# EAGLE design SkiMeter (EAGLE 6.6.0)
VERSION: 1.0
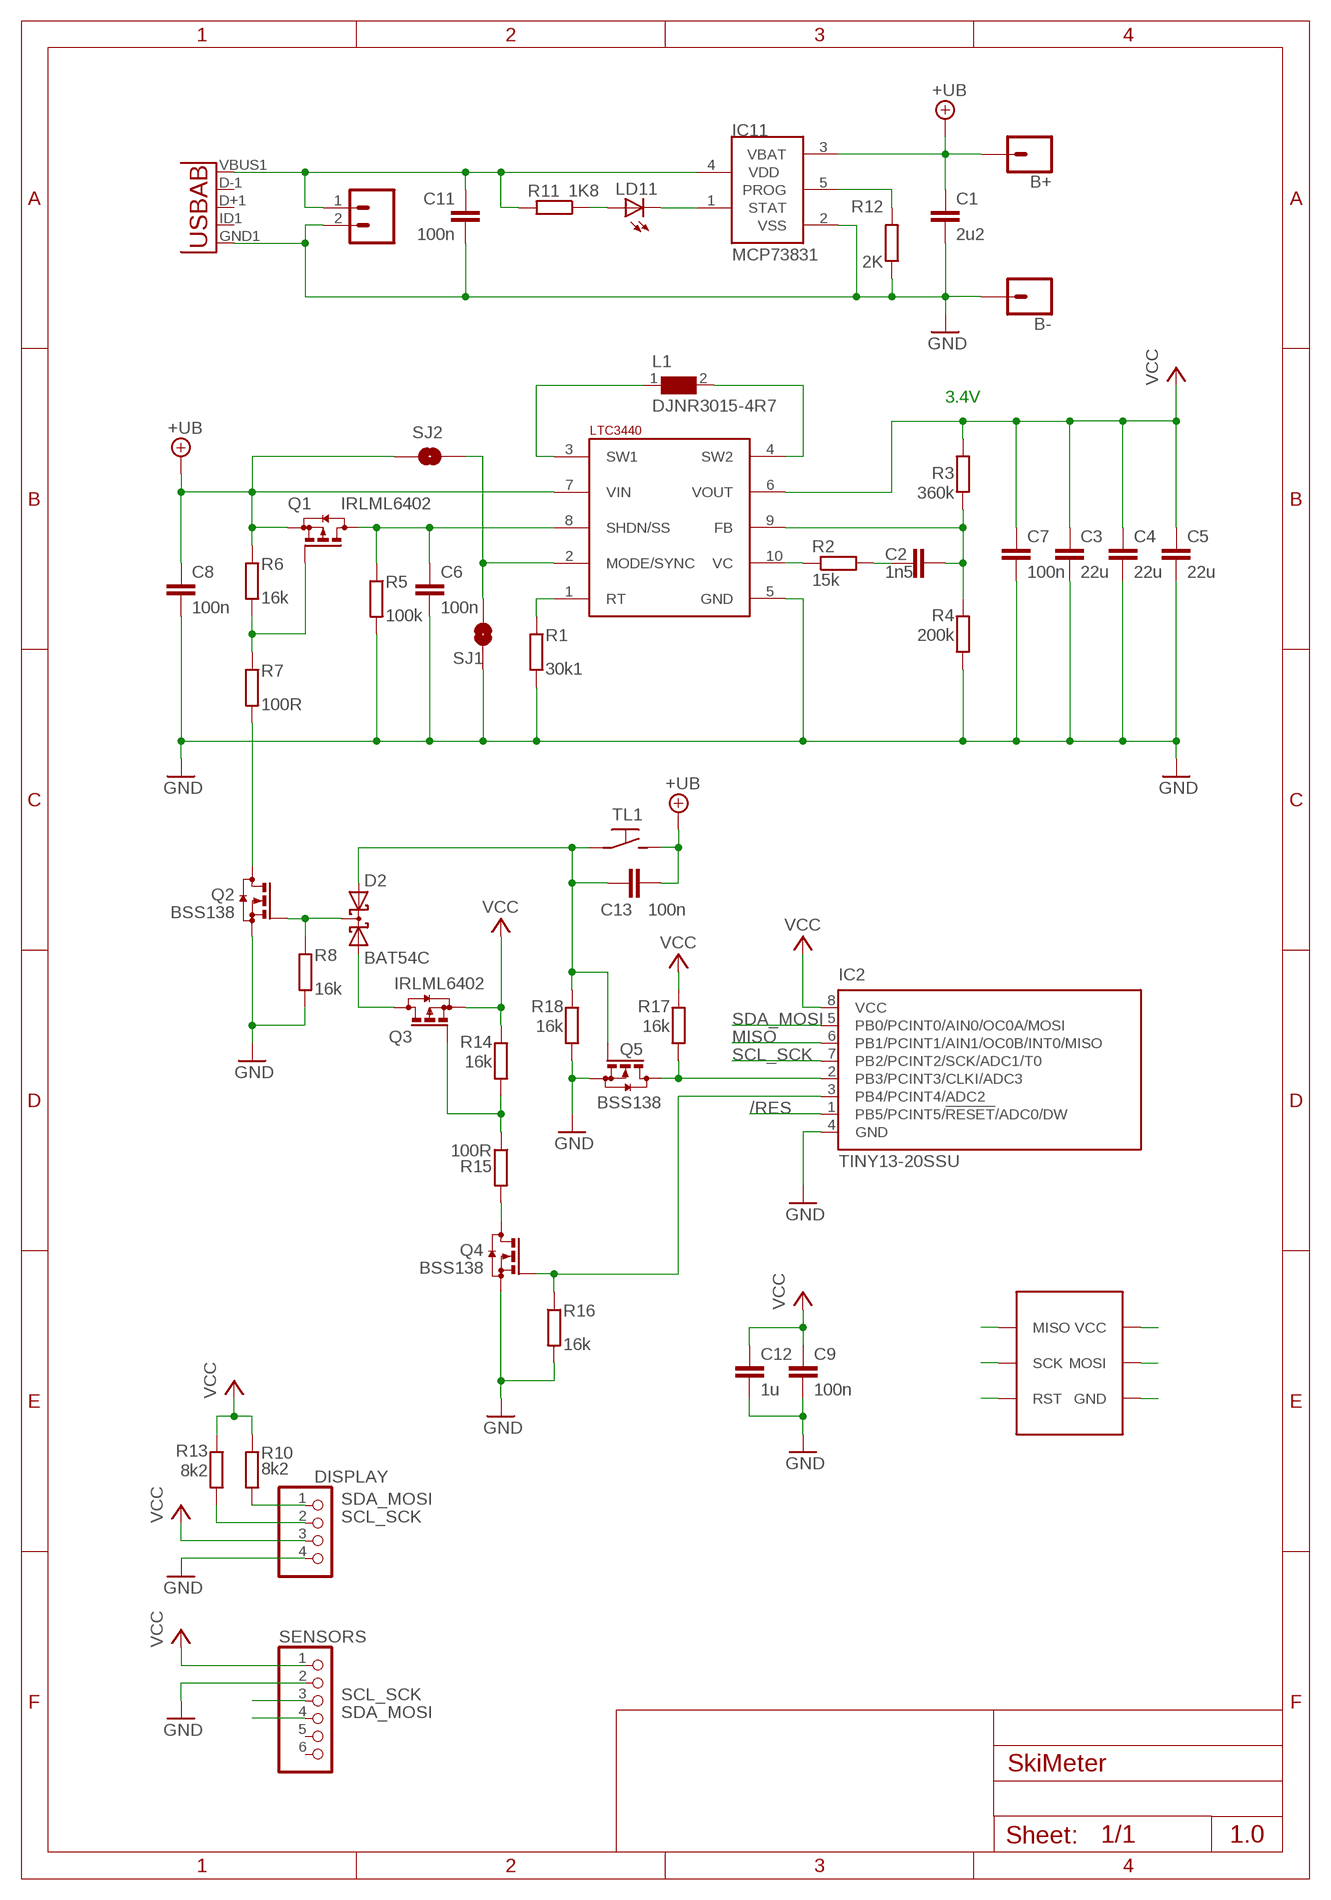
[diagram p0: schematic, sheet 1]

## Parts
+  CONN_02  [1X02]
B+  CONN_01  [1X01]
B-  CONN_01  [1X01]
C1  2u2  C-EUC0805  [C0805]
C2  1n5  C-EUC0805  [C0805]
C3  22u  C-EUC0805  [C0805]
C4  22u  C-EUC0805  [C0805]
C5  22u  C-EUC0805  [C0805]
C6  100n  C-EUC0805  [C0805]
C7  100n  C-EUC0805  [C0805]
C8  100n  C-EUC0805  [C0805]
C9  100n  C-EUC0805  [C0805]
C11  100n  C-EUC0805  [C0805]
C12  1u  C-EUC0805  [C0805]
C13  100n  C-EUC0805  [C0805]
D2  BAT54C  [SOT23]
DISPLAY  PINHD-1X4  [1X04]
IC1  LTC3440  [MSOP10]
IC2  TINY13-20SSU  [8S1]
IC11  MCP73831  [SOT23-5L]
L1  DJNR3015-4R7  WE-LQS_3015  [WE-LQS_3015]
LD11  LEDCHIPLED_0805  [CHIPLED_0805]
Q1  IRLML6402  BSS84  [SOT23]
Q2  BSS138  BSS123  [SOT23]
Q3  IRLML6402  BSS84  [SOT23]
Q4  BSS138  BSS123  [SOT23]
Q5  BSS138  BSS123  [SOT23]
R1  30k1  R-EU_M0805  [M0805]
R2  15k  R-EU_M0805  [M0805]
R3  360k  R-EU_M0805  [M0805]
R4  200k  R-EU_M0805  [M0805]
R5  100k  R-EU_M0805  [M0805]
R6  16k  R-EU_M0805  [M0805]
R7  100R  R-EU_M0805  [M0805]
R8  16k  R-EU_M0805  [M0805]
R10  8k2  R-EU_M0805  [M0805]
R11  1K8  R-EU_M0805  [M0805]
R12  2K  R-EU_M0805  [M0805]
R13  8k2  R-EU_M0805  [M0805]
R14  16k  R-EU_M0805  [M0805]
R15  100R  R-EU_M0805  [M0805]
R16  16k  R-EU_M0805  [M0805]
R17  16k  R-EU_M0805  [M0805]
R18  16k  R-EU_M0805  [M0805]
SENSORS  PINHD-1X6  [1X06]
SJ1  SOLDERJUMPERNO  [SJ_2S-NO]
SJ2  SOLDERJUMPERTRACE  [SJ_2S-TRACE]
TL1  TS1107GS  [TS1107GS]
U1  USB""  [USB-MICRO-SMD]
U$1  ISP  [ISP_PCB]

## Nets
+UB: B+.1 C1.1 C8.1 C13.1 IC1.7(VIN) IC11.3(VBAT) Q1.2(S) R6.1 SJ2.2 TL1.P$2(S)
/RES: IC2.1(PB5/PCINT5/!RESET!/ADC0/DW) U$1.P$5(RST)
FB: C2.2 IC1.9(FB) R3.1 R4.2
GND: +.2 B-.1 C1.2 C3.2 C4.2 C5.2 C6.2 C7.2 C8.2 C9.2 C11.1 C12.2 DISPLAY.4 IC1.5(GND) IC2.4(GND) IC11.2(VSS) Q2.2(S) Q4.2(S) Q5.2(S) R1.2 R4.1 R5.2 R8.2 R12.1 R16.2 R18.2 SENSORS.2 SJ1.1 U1.GND1(GND) U$1.P$6(GND)
MISO: IC2.6(PB1/PCINT1/AIN1/OC0B/INT0/MISO) U$1.P$1(MISO)
N$1: IC1.1(RT) R1.1
N$2: C6.1 IC1.8(SHDN/SS) Q1.3(D) R5.1
N$3: C2.1 R2.2
N$4: Q1.1(G) R6.2 R7.1
N$5: Q2.3(D) R7.2
N$6: IC1.10(VC) R2.1
N$7: D2.3(CC) Q2.1(G) R8.1
N$8: D2.1(A1) Q3.3(D)
N$9: IC11.5(PROG) R12.2
N$10: IC11.1(STAT) LD11.C
N$11: LD11.A R11.1
N$12: C13.2 D2.2(A2) Q5.1(G) R18.1 TL1.P$1(P)
N$13: Q3.1(G) R14.2 R15.1
N$14: Q4.3(D) R15.2
N$15: IC2.3(PB4/PCINT4/ADC2) Q4.1(G) R16.1
N$16: IC2.2(PB3/PCINT3/CLKI/ADC3) Q5.3(D) R17.2
N$17: IC1.2(MODE/SYNC) SJ1.2 SJ2.1
SCL_SCK: DISPLAY.2 IC2.7(PB2/PCINT2/SCK/ADC1/T0) R13.2 SENSORS.3 U$1.P$3(SCK)
SDA_MOSI: DISPLAY.1 IC2.5(PB0/PCINT0/AIN0/OC0A/MOSI) R10.2 SENSORS.4 U$1.P$4(MOSI)
SW1: IC1.3(SW1) L1.1
SW2: IC1.4(SW2) L1.2
U_CHARG: +.1 C11.2 IC11.4(VDD) R11.2 U1.VBUS1(VBUS)
VCC: C3.1 C4.1 C5.1 C7.1 C9.1 C12.1 DISPLAY.3 IC1.6(VOUT) IC2.8(VCC) Q3.2(S) R3.2 R10.1 R13.1 R14.1 R17.1 SENSORS.1 U$1.P$2(VCC)
Unconnected: SENSORS.5 SENSORS.6 U1.D+1(D+) U1.D-1(D-) U1.ID1(USBID)

## Notes on the sheet
- 3.4V

## Library data of the parts
+ = SparkFun-Connectors:CONN_02: Multi connection point. Often used as Generic Header-pin footprint for 0.1 inch spaced/style header connections On any of the 0.1 inch spaced packages, you can populate with these: Break Away Headers - Straight <https://www.sparkfun.com/products/116> (PRT-00116) Break Away Male Headers - Right Angle <https://www.sparkfun.com/products/553> (PRT-00553) Female Headers <https://www.sparkfun.com/products/115> (PRT-00115) Break Away Headers - Machine Pin <https://www.sparkfun.com/products/117> (PRT-00117) Break Away Female Headers - Swiss Machine Pin <https://www.sparkfun.com/products/743> (PRT-00743) For SCREWTERMINALS and SPRING TERMINALS visit here: Screw Terimnals on SparkFun.com <https://www.sparkfun.com/search/results?term=Screw+Terminals> (5mm/3.5mm/2.54mm spacing) This device is also useful as a general connection point to wire up your design to another part of your project. Our various solder wires solder well into these plated through hole pads. Hook-Up Wire - Assortment (Stranded, 22 AWG) <https://www.sparkfun.com/products/11375> (PRT-11375) Hook-Up Wire - Assortment (Solid Core, 22 AWG) <https://www.sparkfun.com/products/11367> (PRT-11367) View the entire wire category on our website here <https://www.sparkfun.com/categories/141> Special notes: Molex polarized connector foot print use with: PRT-08233 with associated crimp pins and housings. 2.54_SCREWTERM for use with PRT-10571. 3.5mm Screw Terminal footprints for PRT-08084 5mm Screw Terminal footprints for use with PRT-08432
B+ B- = SparkFun-Connectors:CONN_01: Single connection point. Often used as Generic Header-pin footprint for 0.1 inch spaced/style header connections On any of the 0.1 inch spaced packages, you can populate with these: Break Away Headers - Straight <https://www.sparkfun.com/products/116> (PRT-00116) Break Away Male Headers - Right Angle <https://www.sparkfun.com/products/553> (PRT-00553) Female Headers <https://www.sparkfun.com/products/115> (PRT-00115) Break Away Headers - Machine Pin <https://www.sparkfun.com/products/117> (PRT-00117) Break Away Female Headers - Swiss Machine Pin <https://www.sparkfun.com/products/743> (PRT-00743) This device is also useful as a general connection point to wire up your design to another part of your project. Our various solder wires solder well into these plated through hole pads. Hook-Up Wire - Assortment (Stranded, 22 AWG) <https://www.sparkfun.com/products/11375> (PRT-11375) Hook-Up Wire - Assortment (Solid Core, 22 AWG) <https://www.sparkfun.com/products/11367> (PRT-11367) View the entire wire category on our website here <https://www.sparkfun.com/categories/141> Special notes: SMTSO-256-ET is a "flush mount" nut for a 4-40 screw. We mostly use this on specialty testbeds; it is a nice way to connect hardware to your PCB at an adjustable hieght. Also note, the SNAP packages are for using a snappable style connector. We sell a baggie of snaps and they are also used on two LilyPad designs: Snap Assortment - 30 pack (male and female) <https://www.sparkfun.com/products/11347> (DEV-11347) LilyPad Arduino SimpleSnap <https://www.sparkfun.com/products/10941> (DEV-10941) LilyPad SimpleSnap Protoboard <https://www.sparkfun.com/products/10940> (DEV-10940)
C1-C9 C11-C13 = rcl:C-EU: CAPACITOR, European symbol
D2 = diode:BAT54C: Schottky Diodes Source: Fairchild .. BAT54.pdf
DISPLAY = pinhead:PINHD-1X4: PIN HEADER
IC1 = seb:LTC3440
IC2 = atmel:TINY13: 8-bit AVR Microcontroller with 1K Bytes In-System Programmable Flash Source: http://www.atmel.com/dyn/resources/prod_documents/2535S.pdf; MPN: ATTINY13-20SSU; OC_FARNELL: 1455133; OC_NEWARK: 58M3771
IC11 = microchip-update-2:MCP73831: Miniature Single-Cell, Fully Integrated Li-Ion, Li-Polymer Charge Management Controllers
L1 = Wurth_Elektronik_Passive_rev15b:WE-LQS_3015: SMD Shielded Tiny Power Inductor -Tiny Power Inductor design -1.7 times more current in comparison with unshielded versions - Robust design& high durability -Low RDC -Magnetically shielded wth magneticc glue reducing buzz noise in ultra-low levels -Operating Temperature:-40°C to +125°C -- Intergrated DC/DC Converters --Switching controllers which required high effiiciency --Portable power(Smartphones,digital cameras,Tablets,etc) --Embedded laptops and PCs --Big sizes(5040,60xx,8040) used for shock-proof circiuts <http://katalog.we-online.de/media/images/eisos/IndLQS_pf2.jpg> Details see: http://katalog.we-online.de/en/pbs/WE-LQS Created by Dan Xu 2014-05-21 2014 (C) Würth Elektronik
LD11 = led:LED: LED OSRAM: - CHIPLED LG R971, LG N971, LY N971, LG Q971, LY Q971, LO R971, LY R971 LH N974, LH R974 LS Q976, LO Q976, LY Q976 LO Q996 - Hyper CHIPLED LW Q18S LB Q993, LB Q99A, LB R99A - SideLED LS A670, LO A670, LY A670, LG A670, LP A670 LB A673, LV A673, LT A673, LW A673 LH A674 LY A675 LS A676, LA A676, LO A676, LY A676, LW A676 LS A679, LY A679, LG A679 - Hyper Micro SIDELED® LS Y876, LA Y876, LO Y876, LY Y876 LT Y87S - SmartLED LW L88C, LW L88S LB L89C, LB L89S, LG L890 LS L89K, LO L89K, LY L89K LS L896, LA L896, LO L896, LY L896 - TOPLED LS T670, LO T670, LY T670, LG T670, LP T670 LSG T670, LSP T670, LSY T670, LOP T670, LYG T670 LG T671, LOG T671, LSG T671 LB T673, LV T673, LT T673, LW T673 LH T674 LS T676, LA T676, LO T676, LY T676, LB T676, LH T676, LSB T676, LW T676 LB T67C, LV T67C, LT T67C, LS T67K, LO T67K, LY T67K, LW E67C LS E67B, LA E67B, LO E67B, LY E67B, LB E67C, LV E67C, LT E67C LW T67C LS T679, LY T679, LG T679 LS T770, LO T770, LY T770, LG T770, LP T770 LB T773, LV T773, LT T773, LW T773 LH T774 LS E675, LA E675, LY E675, LS T675 LS T776, LA T776, LO T776, LY T776, LB T776 LHGB T686 LT T68C, LB T68C - Hyper Mini TOPLED® LB M676 - Mini TOPLED Santana® LG M470 LS M47K, LO M47K, LY M47K Source: http://www.osram.convergy.de LUXEON: - LUMILED® LXK2-PW12-R00, LXK2-PW12-S00, LXK2-PW14-U00, LXK2-PW14-V00 LXK2-PM12-R00, LXK2-PM12-S00, LXK2-PM14-U00 LXK2-PE12-Q00, LXK2-PE12-R00, LXK2-PE12-S00, LXK2-PE14-T00, LXK2-PE14-U00 LXK2-PB12-K00, LXK2-PB12-L00, LXK2-PB12-M00, LXK2-PB14-N00, LXK2-PB14-P00, LXK2-PB14-Q00 LXK2-PR12-L00, LXK2-PR12-M00, LXK2-PR14-Q00, LXK2-PR14-R00 LXK2-PD12-Q00, LXK2-PD12-R00, LXK2-PD12-S00 LXK2-PH12-R00, LXK2-PH12-S00 LXK2-PL12-P00, LXK2-PL12-Q00, LXK2-PL12-R00 Source: www.luxeon.com KINGBRIGHT: KA-3528ASYC Source: www.kingbright.com
Q1 Q3 = transistor-small-signal:BSS84: P-CHANNEL MOS FET
Q2 Q4 Q5 = transistor-small-signal:BSS123: N-CHANNEL MOS FET
R1-R8 R10-R18 = rcl:R-EU_: RESISTOR, European symbol
SENSORS = pinhead:PINHD-1X6: PIN HEADER
SJ1 SJ2 = SteMarie:SOLDERJUMPER: Solder Jumper Standard SMD solder jumper. Used to automate production. Two varients : Normally Open and Normally Closed are the same, but have different paste layers. NC will have a large amount of paste and should jumper during reflow.
TL1 = switchs:TS1107GS
U1 = MicroUSB:USB: This is a USB AB connector that is compatible with USB OTG. i.e. this connector can serve as a host or device
U$1 = isp:ISP

## Board
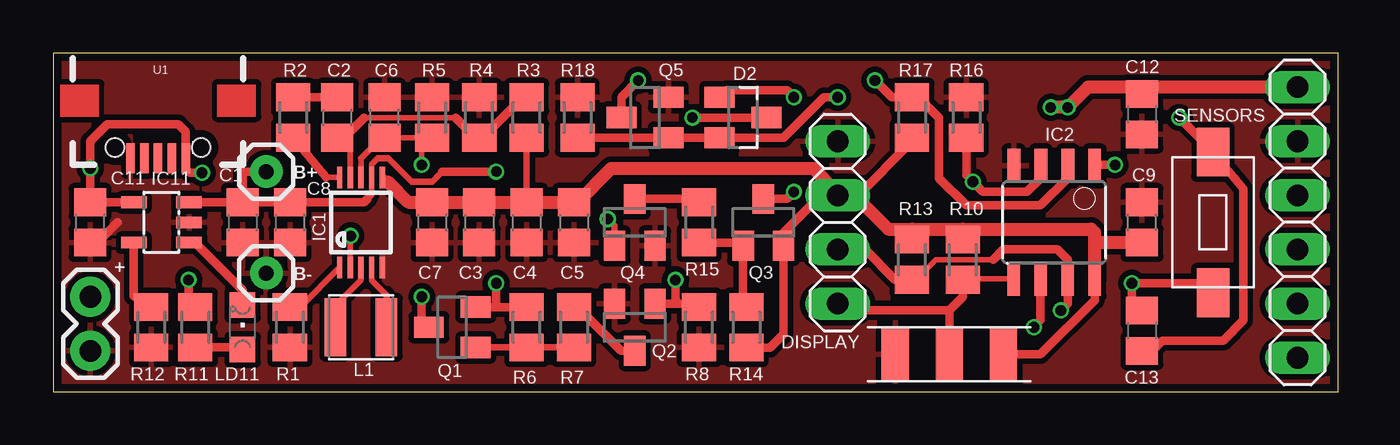
[diagram p1: board, top side]
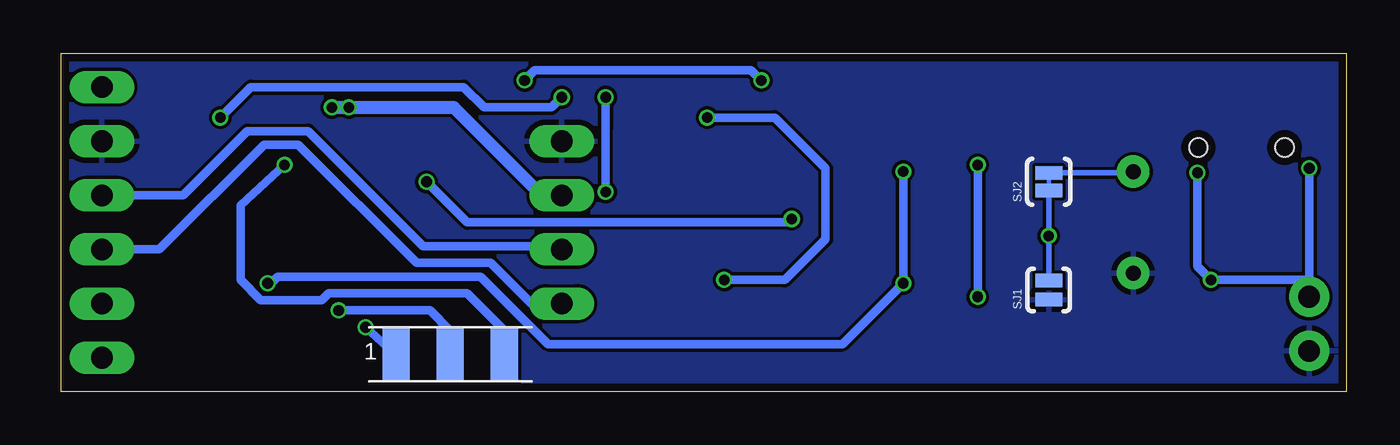
[diagram p2: board, bottom side, seen from below]

Size 60.33 x 15.88 mm. Coordinates in mm from the lower left corner, seen from the top.
Outline: 0,0 60.33,0 60.33,15.88 0,15.88 0,0
Copper layers (1*16): Top 0.035559375mm / dielectric 1.6mm / Bottom 0.035559375mm
Design rules "oshpark-2layer *": minimum track width 6mil, minimum drill 10mil, track to track 6mil, track to pad 6mil, pad to pad 6mil, via to via 6mil, smd to smd 6mil, copper to edge 15mil, drill to drill 6mil, minimum pad ring 5mil, minimum via ring 5mil, stop-mask expansion 0mil, vias tented up to drill 0mil, thermal gap 10mil

### Footprints (pad centres in the part's own frame; a part is rotated, then mirrored left to right if it is on the bottom)
1X02 = drill 1.016 pad 1.88: 1 0,0; 2 2.54,0
1X01 = drill 0.7 pad 1.524: 1 0,0
C0805 = smd 1.3 x 1.5: 1 -0.95,0; 2 0.95,0
SOT23 = smd 1 x 1.4: 1 -0.95,-1.1; 2 0.95,-1.1; 3 0,1.1
1X04 = drill 1.016 long: 1 -3.81,0; 2 -1.27,0; 3 1.27,0; 4 3.81,0
MSOP10 = smd 0.25 x 1: 1 -1,-2.113; 2 -0.5,-2.113; 3 0,-2.113; 4 0.5,-2.113; 5 1,-2.113; 6 1,2.113; 7 0.5,2.113; 8 0,2.113; 9 -0.5,2.113; 10 -1,2.113
8S1 = smd 0.6 x 1.6: 1 -1.905,-2.654; 2 -0.645,-2.654; 3 0.625,-2.654; 4 1.895,-2.654; 5 1.905,2.654; 6 0.635,2.654; 7 -0.635,2.654; 8 -1.905,2.654
SOT23-5L = smd 0.55 x 1.2: 1 -0.95,-1.3; 2 0,-1.3; 3 0.95,-1.3; 4 0.95,1.3; 5 -0.95,1.3
WE-LQS_3015 = smd 1 x 2.7: 1 -1.2,0; 2 1.2,0
CHIPLED_0805 = smd 1.2 x 1.2: A 0,-1.05; C 0,1.05
M0805 = smd 1.3 x 1.6: 1 -0.95,0; 2 0.95,0
1X06 = drill 1.016 long: 1 -6.35,0; 2 -3.81,0; 3 -1.27,0; 4 1.27,0; 5 3.81,0; 6 6.35,0
SJ_2S-NO = smd 0.635 x 1.27: 1 -0.45,0; 2 0.45,0
SJ_2S-TRACE = smd 0.635 x 1.27: 1 -0.419,0; 2 0.419,0
TS1107GS = smd 2.286 x 1.524: P$1 -3.302,0; P$2 3.302,0
USB-MICRO-SMD = smd 1.4 x 0.4: D+1 2.7,0; D-1 2.7,0.65; GND1 2.7,-1.3; ID1 2.7,-0.65; VBUS1 2.7,1.3 | hole 0.85: 2.2,2.027; 2.2,-2.027
ISP_PCB = smd 1.27 x 2.54: P$1 -2.54,0; P$3 0,0; P$5 2.54,0 | smd 1.27 x 2.54 bottom: P$2 -2.54,0; P$4 0,0; P$6 2.54,0

### Placement (x,y rotation side)
+  1.75,4.45 270 top
B+  10,10.32 0 top
B-  10,5.56 0 top
C1  8.89,7.94 270 top
C2  13.34,12.86 270 top
C3  20,7.94 270 top
C4  22.23,7.94 270 top
C5  24.45,7.94 270 top
C6  15.56,12.86 90 top
C7  17.78,7.94 270 top
C8  11.11,7.94 270 top
C9  51.12,7.94 90 top
C11  1.73,7.94 90 top
C12  51.12,13.02 270 top
C13  51.12,2.86 270 top
D2  32.38,12.86 270 top
DISPLAY  36.83,7.94 90 top
IC1  14.45,7.94 0 top
IC2  46.99,7.94 180 top
IC11  5.08,7.94 90 top
L1  14.45,3.02 0 top
LD11  8.89,3.02 0 top
Q1  18.73,3.02 90 top
Q2  27.3,3.02 180 top
Q3  33.34,7.94 0 top
Q4  27.3,7.94 0 top
Q5  27.78,12.86 90 top
R1  11.11,3.02 270 top
R2  11.27,12.86 90 top
R3  22.23,12.86 270 top
R4  20,12.86 270 top
R5  17.78,12.86 90 top
R6  22.23,3.02 270 top
R7  24.45,3.02 90 top
R8  30.32,3.02 270 top
R10  42.7,6.19 270 top
R11  6.67,3.02 90 top
R12  4.6,3.02 90 top
R13  40.32,6.19 270 top
R14  32.54,3.02 90 top
R15  30.32,7.94 90 top
R16  42.86,12.86 90 top
R17  40.32,12.86 90 top
R18  24.61,12.86 90 top
SENSORS  58.42,7.94 270 top
SJ1  13.97,4.76 90 bottom
SJ2  13.97,9.84 90 bottom
TL1  54.45,7.94 270 top
U1  4.92,13.65 270 top
U$1  42.07,1.75 0 bottom

### Tracks (layer width: path | path; a pad name or v marks a point on that pad's centre or on a via)
+UB  (via drill 0.5)
  Top 0.254: 14.76,9.05 14.95,9.23 IC1.7 14.95,10.66 15.24,10.95
  Top 0.305: 15.24,10.95 15.72,10.95 16.83,9.84 17.78,9.84 18.26,10.32
  Top 0.406: 14.76,9.05 14.6,8.89 C8.1 C1.1 | 18.26,10.32 v20.8,10.32 | R6.1 20.8,3.97 | 20.8,3.97 Q1.2 | v20.8,5.08 20.8,3.97 | IC11.3 C1.1 | C1.1 8.89,10.32 B+.1 | TL1.P$2 54.45,5.08 v50.64,5.08 50.64,4.28 C13.1
  Bottom 0.254: SJ2.2 10.06,10.26 B+.1
  Bottom 0.406: v20.8,10.32 v20.8,5.08 23.65,2.22 37.47,2.22 40.64,5.4 50.16,5.4 50.48,5.08 v50.64,5.08
/RES  (via drill 0.5)
  Top 0.406: IC2.1 48.94,10.64 v49.85,10.64
  Bottom 0.406: U$1.P$5 39.21,2.54 41.27,4.6 47.78,4.6 48.1,4.29 50.96,4.29 51.91,5.24 51.91,8.73 v49.85,10.64
FB
  Top 0.254: IC1.9 13.95,11.3 | 13.95,11.3 C2.2 | 13.95,11.3 13.95,12.2 | 14.61,12.86 18.89,12.86 | 19.84,11.91 R4.2 20.16,11.91 | 22.06,13.81 R3.1
  Top 0.406: 13.95,12.2 14.61,12.86 | 18.89,12.86 19.84,11.91 | 20.16,11.91 22.06,13.81
GND
  Top 0.406: 3.02,7.94 2.22,7.14 1.9,7.14 C11.1
  pour Top (isolate 0.254, rank 6): 0,15.88 0,0 60.17,0 60.17,15.88
  pour Top (rank 6, no thermals): 15.56,6.67 15.56,5.08 16.67,5.08 16.67,6.67
  pour Bottom: 0.16,15.72 60.17,15.72 60.17,0.16 0.16,0.16
MISO  (via drill 0.5)
  Top 0.406: IC2.6 46.35,3.33 v46.04,3.02
  Bottom 0.406: v46.04,3.02 44.29,1.43 U$1.P$1
N$1
  Top 0.254: IC1.1 11.59,3.97 R1.1
N$2  (via drill 0.5)
  Top 0.254: IC1.8 14.45,10.96 | C6.1 R5.1 17.31,11.91 v17.3,10.64
  Top 0.305: 17.3,3.35 Q1.3 | 14.45,10.96 15.4,11.91 C6.1
  Top 0.406: v17.3,4.45 17.3,3.35
  Bottom 0.406: v17.3,10.64 v17.3,4.45
N$3
  Top 0.406: C2.1 R2.2
N$4
  Top 0.305: Q1.1 R6.2 R7.1
N$5
  Top 0.406: R7.2 24.61,3.97 26.66,1.92 Q2.3
N$6
  Top 0.254: IC1.10 12.81,10.05
  Top 0.406: 12.81,10.05 R2.1
N$7  (via drill 0.5)
  Top 0.406: Q2.1 29.37,4.12 | 29.37,4.12 30.17,4.12 R8.1 | D2.3 v30,12.86 | v29.21,5.24 29.21,4.28 29.37,4.12
  Bottom 0.406: v30,12.86 26.83,12.86 24.45,10.48 24.45,7.14 26.35,5.24 v29.21,5.24
N$8  (via drill 0.5)
  Top 0.406: D2.1 31.61,14.13 34.45,14.13 v34.77,13.81 | Q3.3 34.44,9.04 v34.77,9.37
  Bottom 0.406: 34.77,12.38 v34.77,13.81 v34.77,9.37
N$9
  Top 0.406: R12.2 3.78,4.47 IC11.5
N$10
  Top 0.406: LD11.C 8.89,4.76 6.67,6.99 IC11.1
N$11
  Top 0.406: LD11.A 8.79,2.07 R11.1
N$12  (via drill 0.5)
  Top 0.406: v36.83,13.81 36.2,13.81 34.29,11.91 D2.2 Q5.1 R18.1 | v52.86,12.86 54.17,11.56 | 54.17,11.56 TL1.P$1 | 54.17,11.56 55.88,9.53 55.88,3.33 54.93,2.38 52.07,2.38 51.75,2.06 51.27,2.06 C13.2
  Bottom 0.406: v52.86,12.86 51.44,14.29 41.43,14.29 40.48,13.34 37.31,13.34 v36.83,13.81
N$13
  Top 0.406: R15.1 32.38,6.99 Q3.1 32.39,4.12 R14.2
N$14
  Top 0.406: Q4.3 30.17,9.04 R15.2
N$15  (via drill 0.5)
  Top 0.305: 46.37,10.01 IC2.3 46.35,10.76 | v43.18,9.84 42.86,10.16 | Q4.1 26.36,7.78 v26.04,8.1
  Top 0.406: 46.37,10.01 45.72,9.37 43.66,9.37 v43.18,9.84 | 42.86,10.16 R16.1
  Bottom 0.406: v26.04,8.1 26.19,7.94 41.27,7.94 v43.18,9.84
N$16  (via drill 0.5)
  Top 0.305: IC2.2 47.63,10.01 | 40.33,13.49 R17.2
  Top 0.406: 47.63,10.01 46.35,8.73 42.86,8.73 41.59,10 41.59,12.86 40.48,13.97 R17.2 39.37,13.81 v38.58,14.61 | v27.46,14.61 26.68,13.82 Q5.3
  Bottom 0.406: v38.58,14.61 38.1,15.08 27.94,15.08 v27.46,14.61
N$17  (via drill 0.5)
  Top 0.254: IC1.2 13.95,7.17 v13.97,7.3
  Bottom 0.254: SJ1.2 v13.97,7.3 SJ2.1
SCL_SCK  (via drill 0.5)
  Top 0.254: R13.2 40.48,5.24 41.43,6.19 44.13,6.19
  Top 0.406: 44.13,6.19 44.61,6.67 47.15,6.67 47.62,6.19 IC2.7 47.62,4.13 v47.31,3.81 | R13.2 39.53,5.24 38.1,6.67 DISPLAY.2
  Bottom 0.406: v47.31,3.81 43.02,3.81 42.07,2.86 U$1.P$3 | SENSORS.3 54.61,9.21 51.59,12.22 48.74,12.22 43.34,6.83 36.83,6.83 DISPLAY.2
SDA_MOSI
  Top 0.254: IC2.5 42.75,5.28 R10.2
  Top 0.406: DISPLAY.1 37.31,3.81 42.07,3.81 | 42.07,3.81 42.7,4.45 R10.2 | 42.07,3.81 U$1.P$4
  Bottom 0.406: SENSORS.4 55.72,6.67 50.8,11.59 49.21,11.59 43.66,6.03 40.16,6.03 38.26,4.13 DISPLAY.1
SW1
  Top 0.254: IC1.3 14.45,5.24 14.29,5.08
  Top 0.305: 14.29,5.08 13.34,4.13 13.34,3.1 L1.1
SW2
  Top 0.254: IC1.4 14.95,5.21 15.08,5.08
  Top 0.305: 15.08,5.08 15.65,4.51 L1.2
U_CHARG  (via drill 0.5)
  Top 0.406: IC11.4 C11.2 | 1.59,8.9 C11.2 | C11.2 v1.73,10.48 1.73,11.73 2.54,12.54 5.87,12.54 6.22,12.19 U1.VBUS1 | R11.2 6.35,4.29 v6.35,5.24 | 6.22,10.92 U1.VBUS1 | U1.VBUS1 6.22,10.77 | v6.99,10.27 6.4,10.27 6.35,10.32
  Bottom 0.406: v6.99,10.27 6.99,5.87 v6.35,5.24 1.75,5.24 1.75,5.08 | 1.73,4.46 +.1 1.75,5.08 | v1.73,10.48 1.73,5.56 | 1.73,5.56 1.75,5.56 | 1.73,5.56 1.73,5.08 1.75,5.08
VCC  (via drill 0.5)
  Top 0.254: IC1.6 15.51,10.05 15.72,9.84 | R10.1 42.7,7.62 | R14.1
  Top 0.305: R3.2 C4.1 | R13.1 40.32,7.62 | R17.1 40.33,11.75
  Top 0.406: 40.33,11.75 37.7,9.13 | U$1.P$2 46.35,1.75 48.9,4.29 IC2.8 | R14.1 33.66,2.06 34.29,2.7 Q3.2 34.29,7.46 36.04,9.21 DISPLAY.3 | C12.1 50.8,14.29
  Top 0.61: 15.72,9.84 16.67,8.89 C7.1 C3.1 C4.1 22.38,8.89 22.39,8.89 C5.1 24.6,8.89 26.19,10.48 35.72,10.48 DISPLAY.3 37.62,9.21 37.7,9.13 39.21,7.62 40.32,7.62 42.7,7.62 48.74,7.62 48.9,7.46 48.9,6.99 | IC2.8 48.9,6.99 | C9.1 48.9,6.99 | SENSORS.1 50.8,14.29 48.58,14.29 v47.62,13.34 v46.83,13.34
  Bottom 0.61: v47.62,13.34 41.91,13.34 37.86,9.29 36.91,9.29 DISPLAY.3